# EAGLE design light (EAGLE 6.0)
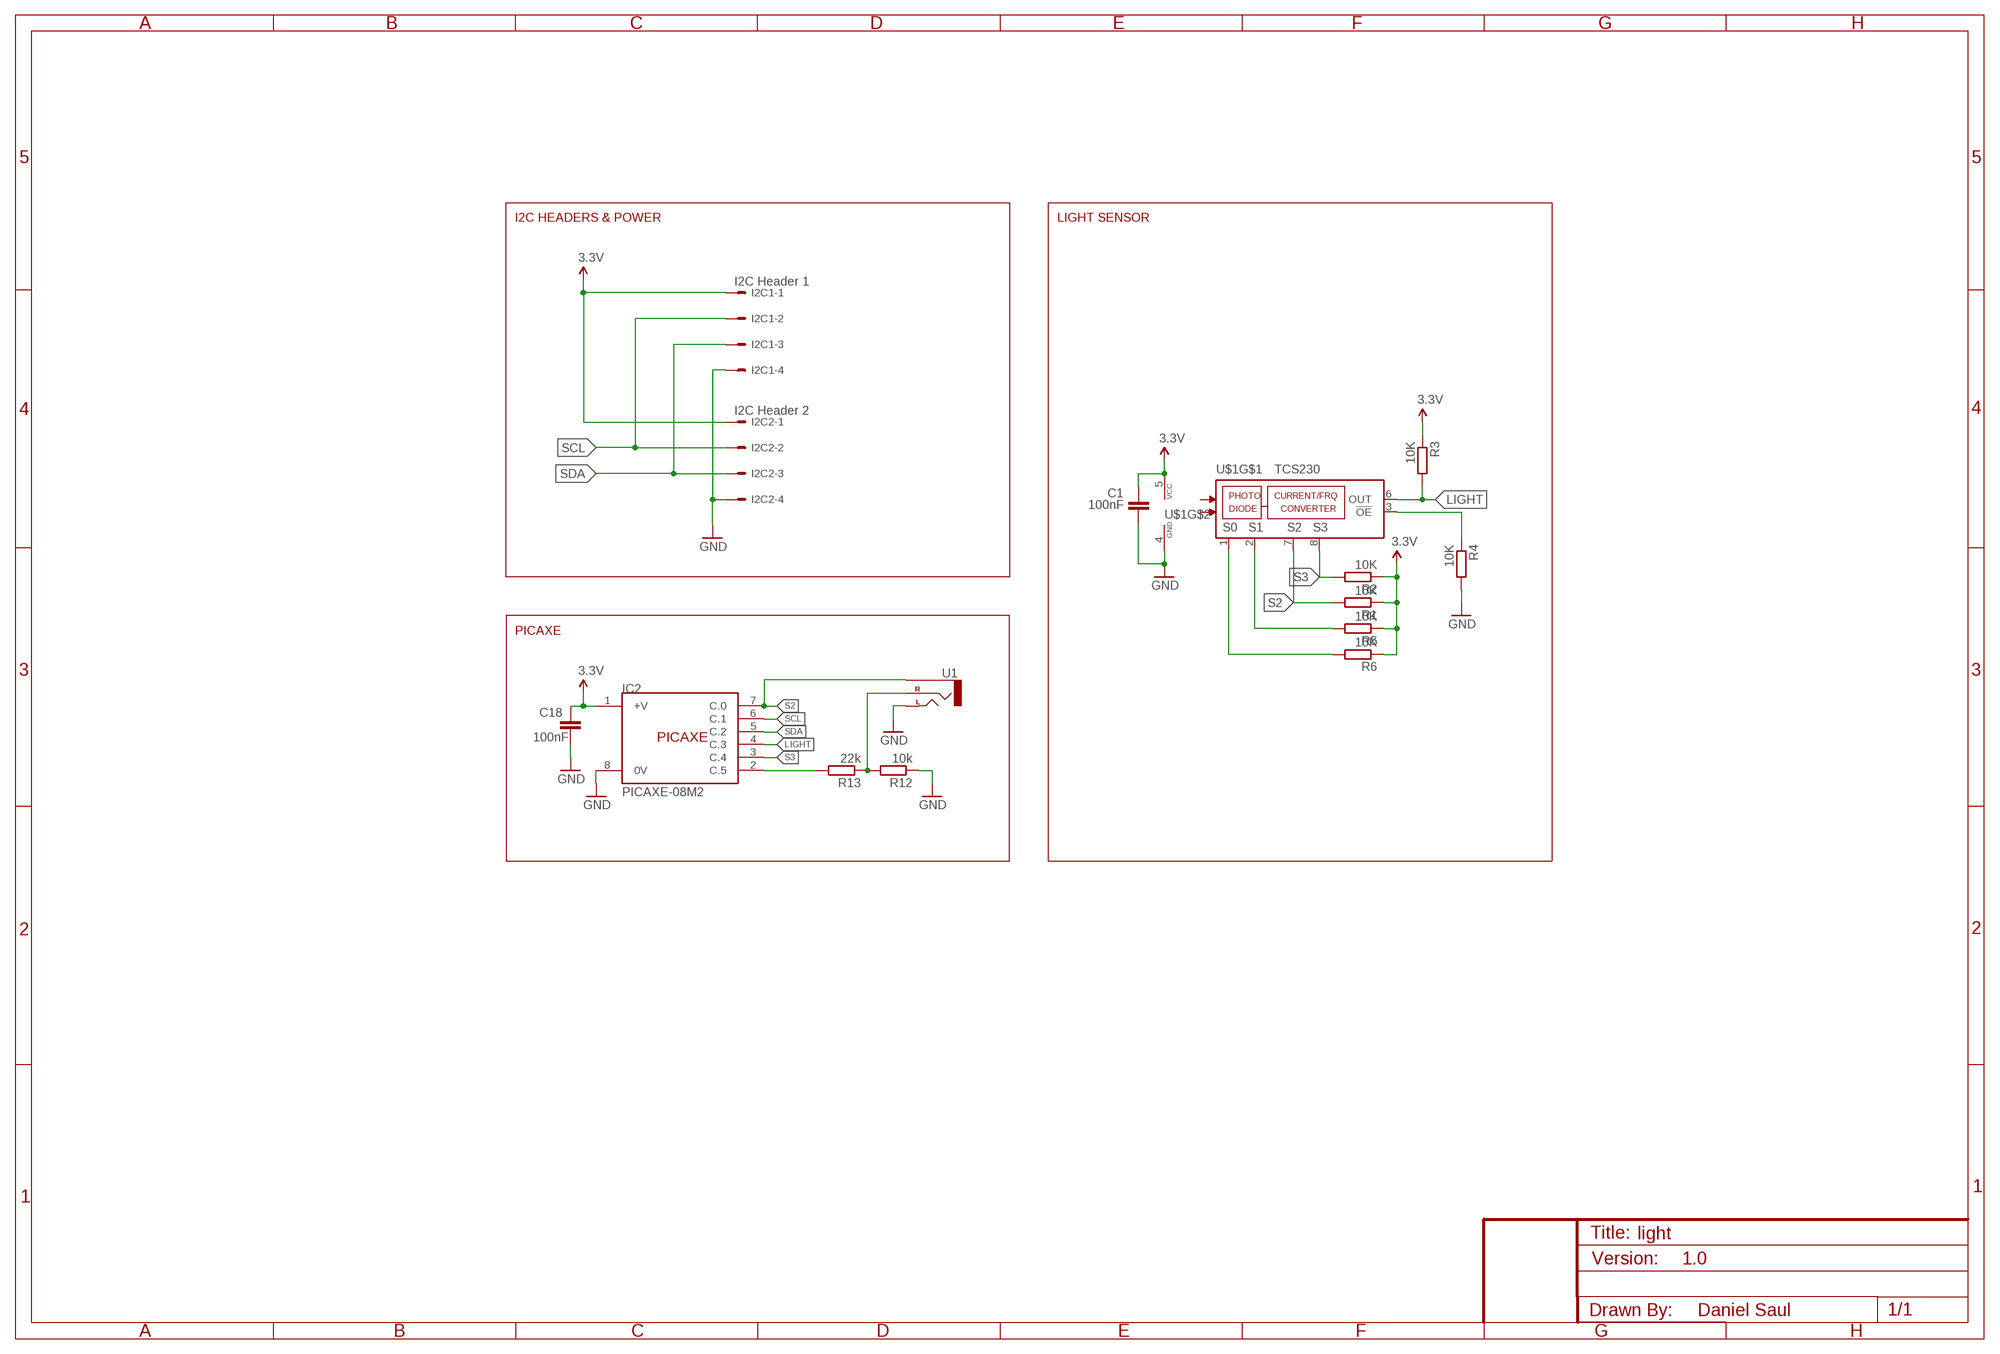
[diagram p0: schematic, sheet 1]

## Parts
C1  100nF  C-EUC0805  [C0805]
C18  100nF  C-EUC0805  [C0805]
I2C1  I2C Header 1  22-27-2041-04  [6410-04]
I2C2  I2C Header 2  22-27-2041-04  [6410-04]
IC2  PICAXE-08M2  [SOIC8]
R1  10K  R-EU_R0805  [R0805]
R2  10K  R-EU_R0805  [R0805]
R3  10K  R-EU_R0805  [R0805]
R4  10K  R-EU_R0805  [R0805]
R5  10K  R-EU_R0805  [R0805]
R6  10K  R-EU_R0805  [R0805]
R12  10k  R-EU_R0805  [R0805]
R13  22k  R-EU_R0805  [R0805]
U1  AUDIO-JACKPTH  [AUDIO-JACK]
U$1  TCS230  [SOIC8]

## Nets
3.3V: C1.1 C18.1 I2C1.1 I2C2.1 IC2.1(+V) R1.1 R2.1 R3.1 R5.1 R6.1 U$1.5(VCC)
GND: C1.2 C18.2 I2C1.4 I2C2.4 IC2.8(0V) R4.2 R12.1 U1.TIP(LEFT) U$1.4(GND)
LIGHT: IC2.4(C.3) R3.2 U$1.6(OUT)
N$1: R5.2 U$1.2(S1)
N$2: R4.1 U$1.3(!OE)
N$3: R6.2 U$1.1(S0)
N$17: IC2.2(C.5) R13.2
N$20: R12.2 R13.1 U1.RING(RIGHT)
S2: IC2.7(C.0) R1.2 U1.SLEEVE U$1.7(S2)
S3: IC2.3(C.4) R2.2 U$1.8(S3)
SCL: I2C1.2 I2C2.2 IC2.6(C.1)
SDA: I2C1.3 I2C2.3 IC2.5(C.2)

## Notes on the sheet
- I2C HEADERS & POWER | LIGHT SENSOR
- PICAXE
- 1.0
- Daniel Saul

## Library data of the parts
C1 C18 = rcl:C-EU: CAPACITOR, European symbol
I2C1 I2C2 = apex:22-?-04: CONNECTOR wire to board 2.54 mm (.1 inch) pitch header; OC_FARNELL: unknown; OC_NEWARK: unknown
IC2 = apex:PICAXE-08M2
R1-R6 R12 R13 = rcl:R-EU_: RESISTOR, European symbol
U1 = SparkFun:AUDIO-JACK: 3.5mm Audio Jack Simple 3.5mm common PCB mount audio jack. SKU: PRT-08032
U$1 = apex:TCS230

## Board
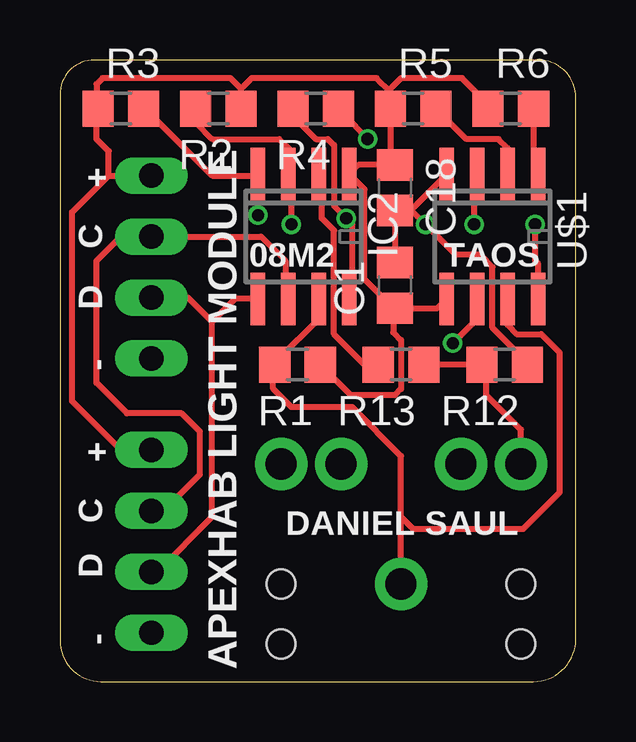
[diagram p1: board, top side]
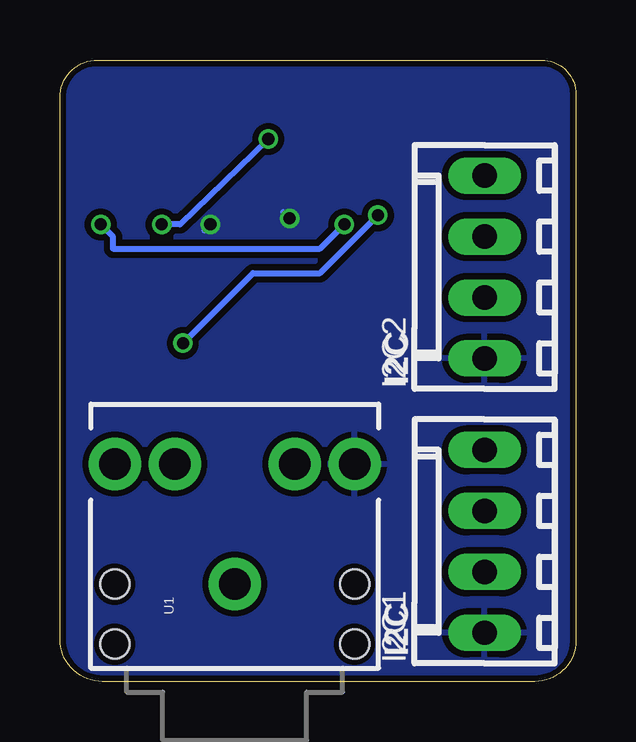
[diagram p2: board, bottom side, seen from below]

Size 21.51 x 25.9 mm. Coordinates in mm from the lower left corner, seen from the top.
Outline: 19.95,25.9 1.43,25.9 arc90 0,24.47 0,1.7 arc90 1.7,0 19.75,0 arc90 21.51,1.77 21.51,24.34 arc90 19.95,25.9
Copper layers (1*16): Top 0.035mm / dielectric 1.5mm / Bottom 0.035mm
Design rules: minimum track width 6mil, minimum drill 12mil, track to track 6mil, track to pad 6mil, pad to pad 6mil, via to via 6mil, smd to smd 0mil, copper to edge 10mil, drill to drill 10mil, minimum pad ring 10mil, minimum via ring 6mil, stop-mask expansion 2mil, vias tented up to drill 100mil, thermal gap 10mil

### Footprints (pad centres in the part's own frame; a part is rotated, then mirrored left to right if it is on the bottom)
C0805 = smd 1.3 x 1.5: 1 -0.95,0; 2 0.95,0
6410-04 = drill 1.016 long: 1 3.81,0; 2 1.27,0; 3 -1.27,0; 4 -3.81,0
SOIC8 = smd 0.6 x 2.2: 1 -1.905,-2.6; 2 -0.635,-2.6; 3 0.635,-2.6; 4 1.905,-2.6; 5 1.905,2.6; 6 0.635,2.6; 7 -0.635,2.6; 8 -1.905,2.6
R0805 = smd 1.3 x 1.5: 1 -0.95,0; 2 0.95,0
AUDIO-JACK = drill 1.3 pad 2.184: RING 5,5; RSH 5,2.5; SLEEVE 0,0; TIP 5,-5; TSH 5,-2.5 | hole 1.2: 0,5; -2.5,5; -2.5,-5; 0,-5

### Placement (x,y rotation side)
C1  13.97,16.51 90 top
C18  13.97,20.57 270 top
I2C1  3.81,5.84 90 bottom
I2C2  3.81,17.27 90 bottom
IC2  10.16,18.54 180 top
R1  9.91,13.21 180 top
R2  6.6,23.88 180 top
R3  2.54,23.88 0 top
R4  10.67,23.88 180 top
R5  14.73,23.88 0 top
R6  18.8,23.88 0 top
R12  18.54,13.21 180 top
R13  14.22,13.21 180 top
U1  14.22,4.06 90 bottom
U$1  18.03,18.54 180 top

### Tracks (layer width: path | path; a pad name or v marks a point on that pad's centre or on a via)
3.3V
  Top 0.254: I2C1.1 2.54,9.65 0.51,11.68 0.51,19.56 2.03,21.08 | 2.03,21.08 I2C2.1 | 2.03,21.08 2.03,22.1 1.52,22.61 1.52,23.81 R3.1 1.52,23.94 1.52,24.89 1.78,25.15 7.11,25.15 7.55,24.7 | R2.1 7.55,24.7 | R6.1 17.85,24.06 16.76,25.15 14.22,25.15 13.72,24.64 13.72,23.94 R5.1 | R5.1 13.78,24.57 13.21,25.15 8,25.15 7.55,24.7 | R5.1 13.78,21.71 C18.1 12.45,21.52 IC2.1 12.7,20.51 12.7,16.76 13.9,15.56 | U$1.5 15.75,15.56 C1.1 13.9,15.56 | 13.9,15.56 13.9,14.54 14.22,14.22 14.22,12.19 13.97,11.94 12.13,11.94 R1.1
GND  (via drill 0.51)
  Top 0.254: IC2.8 12.19,15.24 12.19,19.05 v11.94,19.3 11.43,19.81 11.43,22.35 11.18,22.61 10.67,22.61 9.72,23.56 R4.2 | C18.2 C1.2 | C18.2 14.61,19.62 U$1.4 | C18.2 14.67,19.62 v15.24,19.05 16.51,17.78 17.53,17.78 18.03,17.27 18.03,14.73 19.49,13.27 R12.1
  Bottom 0.254: v11.94,19.3 12.19,19.56 | v15.24,19.05 15.49,18.8
  pour Bottom (isolate 0.254): 0,0 0,25.91 21.59,25.91 21.59,0
LIGHT  (via drill 0.51)
  Top 0.254: R3.2 3.56,23.88 6.35,21.08 8.2,21.08 IC2.4 v8.26,19.43 | U$1.6 17.4,15.11 v16.38,14.1
  Bottom 0.254: v16.38,14.1 13.46,17.02 10.67,17.02 v8.26,19.43 8.13,19.56
N$1
  Top 0.254: U$1.2 18.67,22.23 18.29,22.61 16.95,22.61 R5.2
N$2  (via drill 0.51)
  Top 0.254: R4.1 11.68,23.88 v12.83,22.61 | v17.27,19.05 17.27,21.02 U$1.3
  Bottom 0.254: v12.83,22.61 16.51,19.05 v17.27,19.05
N$3
  Top 0.254: R6.2 19.75,21.34 U$1.1
N$17
  Top 0.254: R13.2 12.7,13.21 11.43,14.48 11.43,18.8 10.92,19.3 10.92,21.02 IC2.2
N$20
  Top 0.254: U1.RING 19.22,10.49 17.78,11.94 17.78,13.02 R12.2 R13.1
S2
  Top 0.254: U1.SLEEVE 14.22,6.86 | 14.22,6.86 14.22,9.4 12.19,11.43 9.65,11.43 8.89,12.19 8.89,13.14 R1.2 8.96,13.27 10.92,15.24 10.92,15.81 IC2.7 | U$1.7 18.67,14.86 19.05,14.48 20.07,14.48 20.83,13.72 20.83,7.87 19.3,6.35 14.73,6.35 14.22,6.86
S3  (via drill 0.51)
  Top 0.254: R2.2 5.65,23.3 6.35,22.61 9.14,22.61 9.65,22.1 9.65,21.27 IC2.3 9.65,21.02 v9.65,19.05 | U$1.8 19.94,17.4 19.81,17.53 v19.81,19.05
  Bottom 0.254: v9.65,19.05 10.67,18.03 19.3,18.03 19.3,18.54 v19.81,19.05
SCL
  Top 0.254: I2C1.2 4.32,7.11 5.84,8.64 5.84,10.41 5.08,11.18 2.79,11.18 1.52,12.45 1.52,17.53 2.54,18.54 I2C2.2 8.38,18.54 9.4,17.53 9.4,16.07 IC2.6
SDA
  Top 0.254: I2C1.3 4.06,4.57 6.35,6.86 6.35,14.99 | 6.35,14.99 5.33,16 I2C2.3 | IC2.5 7.31,15.94 6.35,14.99

### Text on the board
tPlace: + | C | 08M2 | TAOS | D | - | + | C | DANIEL SAUL | D | - | APEXHAB LIGHT MODULE
bPlace: I2C | I2C